# EAGLE schematic encore Main Board (EAGLE 9.6.2)
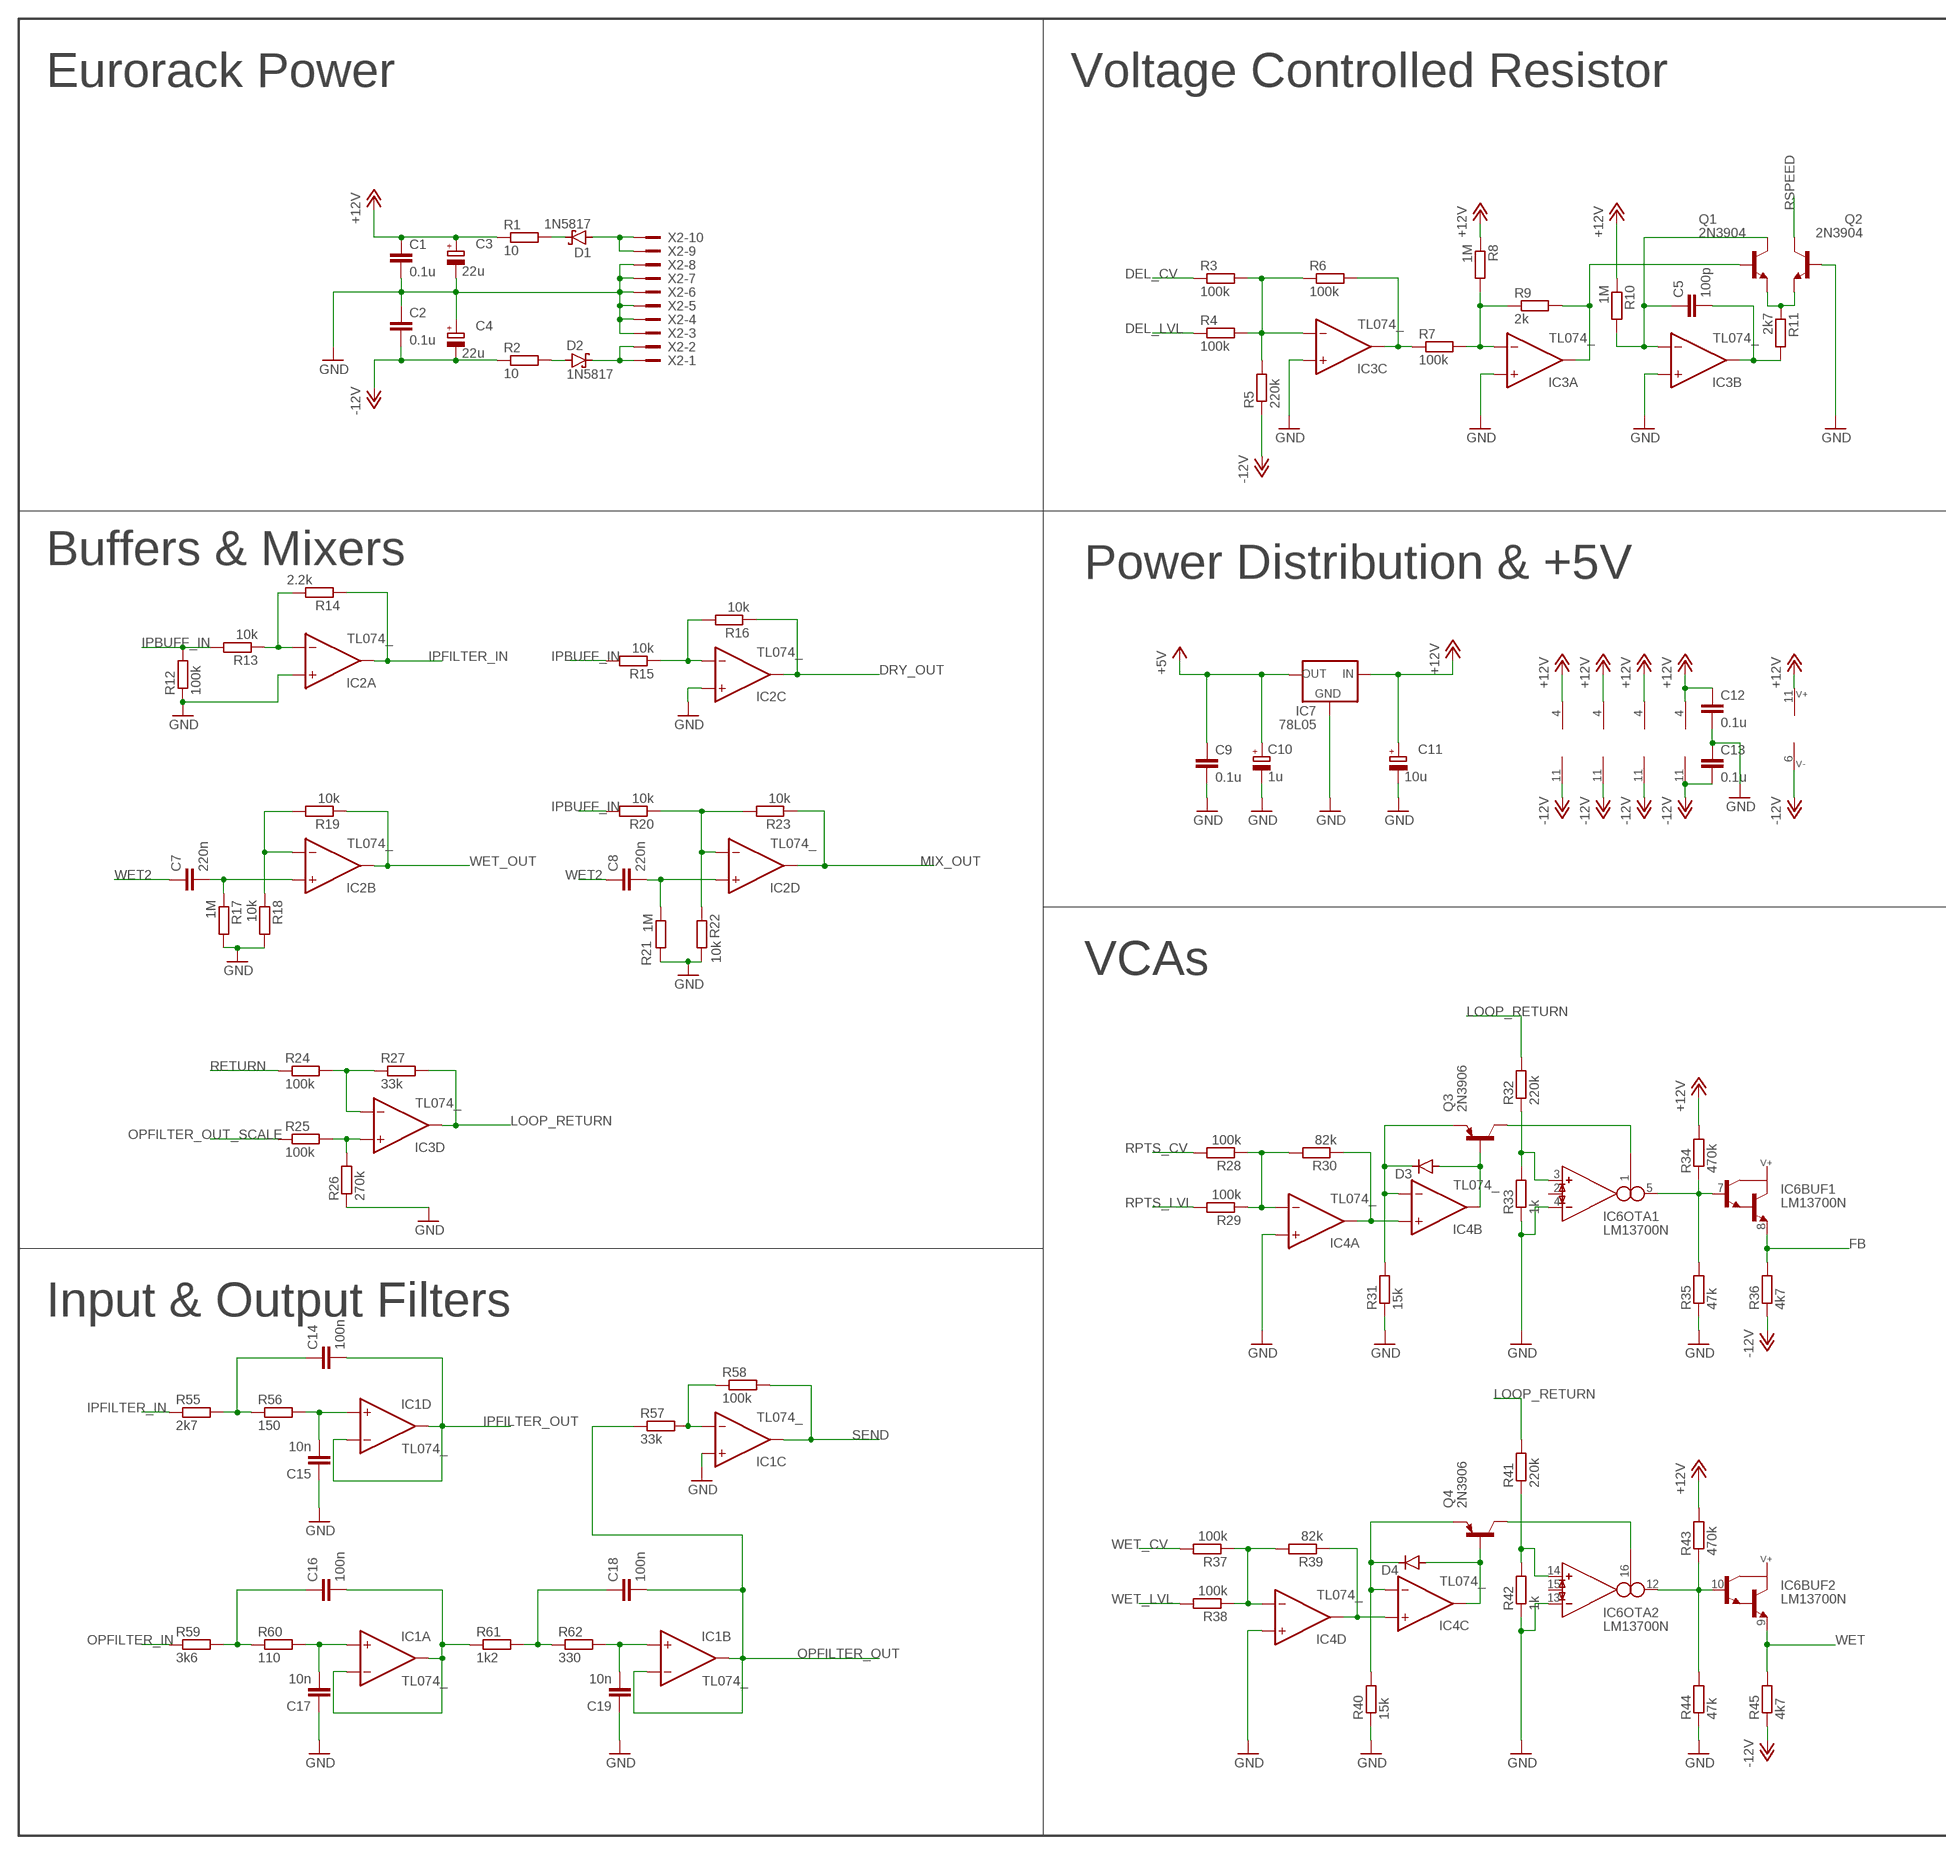
[diagram p0: schematic, sheet 1, part 1 of 2]
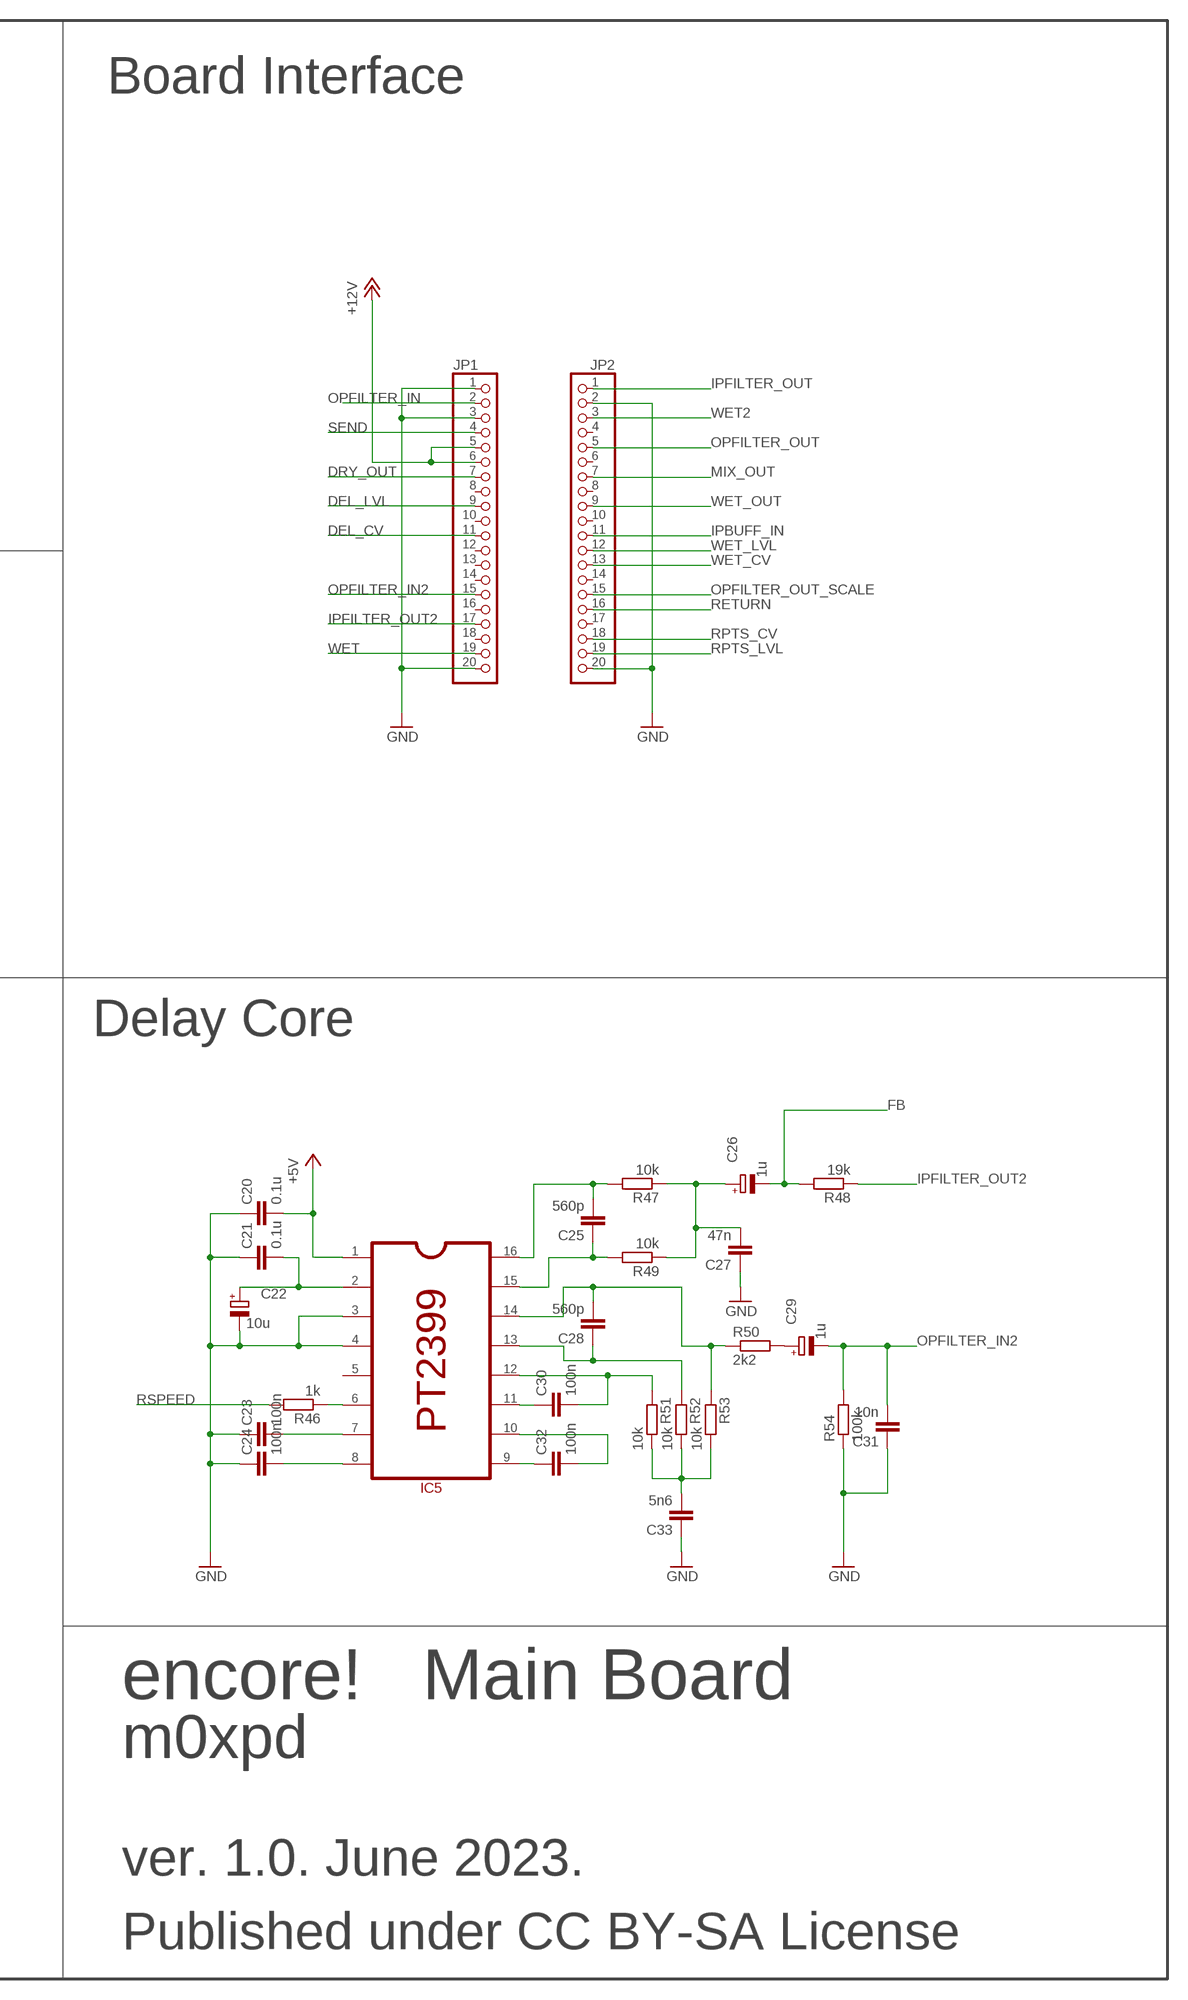
[diagram p1: schematic, sheet 1, part 2 of 2]

## Parts
C1  0.1u  C-EU050-025X075  [C050-025X075]
C2  0.1u  C-EU050-025X075  [C050-025X075]
C3  22u  CPOL-EUE2.5-5  [E2,5-5]
C4  22u  CPOL-EUE2.5-5  [E2,5-5]
C5  100p  C-EU025-025X050  [C025-025X050]
C7  220n  C-EU050-024X044  [C050-024X044]
C8  220n  C-EU050-024X044  [C050-024X044]
C9  0.1u  C-EU050-025X075  [C050-025X075]
C10  1u  CPOL-EUE2.5-5  [E2,5-5]
C11  10u  CPOL-EUE2.5-5  [E2,5-5]
C12  0.1u  C-EU050-025X075  [C050-025X075]
C13  0.1u  C-EU050-025X075  [C050-025X075]
C14  100n  C-EU025-025X050  [C025-025X050]
C15  10n  C-EU025-025X050  [C025-025X050]
C16  100n  C-EU025-025X050  [C025-025X050]
C17  10n  C-EU025-025X050  [C025-025X050]
C18  100n  C-EU025-025X050  [C025-025X050]
C19  10n  C-EU025-025X050  [C025-025X050]
C20  0.1u  C-EU050-025X075  [C050-025X075]
C21  0.1u  C-EU050-025X075  [C050-025X075]
C22  10u  CPOL-EUE2.5-5  [E2,5-5]
C23  100n  C-EU050-025X075  [C050-025X075]
C24  100n  C-EU050-025X075  [C050-025X075]
C25  560p  C-EU025-025X050  [C025-025X050]
C26  1u  CPOL-EUE2.5-5  [E2,5-5]
C27  47n  C-EU050-025X075  [C050-025X075]
C28  560p  C-EU025-025X050  [C025-025X050]
C29  1u  CPOL-EUE2.5-5  [E2,5-5]
C30  100n  C-EU050-025X075  [C050-025X075]
C31  10n  C-EU025-025X050  [C025-025X050]
C32  100n  C-EU050-025X075  [C050-025X075]
C33  5n6  C-EU050-025X075  [C050-025X075]
D1  1N5817  SCHOTTKY-DIODEDO35-7  [DO35-7]
D2  1N5817  SCHOTTKY-DIODEDO35-7  [DO35-7]
D3  1N4148DO35-7  [DO35-7]
D4  1N4148DO35-7  [DO35-7]
IC1  TL074_  [DIL14]
IC2  TL074_  [DIL14]
IC3  TL074_  [DIL14]
IC4  TL074_  [DIL14]
IC5  PT2399  [DIP-16]
IC6  LM13700N  [DIL16]
IC7  78L05  78LXX  [78LXX]
JP1  PINHD-1X20  [1X20]
JP2  PINHD-1X20  [1X20]
Q1  2N3904  [TO92]
Q2  2N3904  [TO92]
Q3  2N3906  [TO92]
Q4  2N3906  [TO92]
R1  10  R-EU_0204/7  [0204/7]
R2  10  R-EU_0204/7  [0204/7]
R3  100k  R-EU_0204/7  [0204/7]
R4  100k  R-EU_0204/7  [0204/7]
R5  220k  R-EU_0204/7  [0204/7]
R6  100k  R-EU_0204/7  [0204/7]
R7  100k  R-EU_0204/7  [0204/7]
R8  1M  R-EU_0204/7  [0204/7]
R9  2k  R-EU_0204/7  [0204/7]
R10  1M  R-EU_0204/7  [0204/7]
R11  2k7  R-EU_0204/7  [0204/7]
R12  100k  R-EU_0204/7  [0204/7]
R13  10k  R-EU_0204/7  [0204/7]
R14  2.2k  R-EU_0204/7  [0204/7]
R15  10k  R-EU_0204/7  [0204/7]
R16  10k  R-EU_0204/7  [0204/7]
R17  1M  R-EU_0204/7  [0204/7]
R18  10k  R-EU_0204/7  [0204/7]
R19  10k  R-EU_0204/7  [0204/7]
R20  10k  R-EU_0204/7  [0204/7]
R21  1M  R-EU_0204/7  [0204/7]
R22  10k  R-EU_0204/7  [0204/7]
R23  10k  R-EU_0204/7  [0204/7]
R24  100k  R-EU_0204/7  [0204/7]
R25  100k  R-EU_0204/7  [0204/7]
R26  270k  R-EU_0204/7  [0204/7]
R27  33k  R-EU_0204/7  [0204/7]
R28  100k  R-EU_0204/7  [0204/7]
R29  100k  R-EU_0204/7  [0204/7]
R30  82k  R-EU_0204/7  [0204/7]
R31  15k  R-EU_0204/7  [0204/7]
R32  220k  R-EU_0204/7  [0204/7]
R33  1k  R-EU_0204/7  [0204/7]
R34  470k  R-EU_0204/7  [0204/7]
R35  47k  R-EU_0204/7  [0204/7]
R36  4k7  R-EU_0204/7  [0204/7]
R37  100k  R-EU_0204/7  [0204/7]
R38  100k  R-EU_0204/7  [0204/7]
R39  82k  R-EU_0204/7  [0204/7]
R40  15k  R-EU_0204/7  [0204/7]
R41  220k  R-EU_0204/7  [0204/7]
R42  1k  R-EU_0204/7  [0204/7]
R43  470k  R-EU_0204/7  [0204/7]
R44  47k  R-EU_0204/7  [0204/7]
R45  4k7  R-EU_0204/7  [0204/7]
R46  1k  R-EU_0204/7  [0204/7]
R47  10k  R-EU_0204/7  [0204/7]
R48  19k  R-EU_0204/7  [0204/7]
R49  10k  R-EU_0204/7  [0204/7]
R50  2k2  R-EU_0204/7  [0204/7]
R51  10k  R-EU_0204/7  [0204/7]
R52  10k  R-EU_0204/7  [0204/7]
R53  10k  R-EU_0204/7  [0204/7]
R54  100k  R-EU_0204/7  [0204/7]
R55  2k7  R-EU_0204/7  [0204/7]
R56  150  R-EU_0204/7  [0204/7]
R57  33k  R-EU_0204/7  [0204/7]
R58  100k  R-EU_0204/7  [0204/7]
R59  3k6  R-EU_0204/7  [0204/7]
R60  110  R-EU_0204/7  [0204/7]
R61  1k2  R-EU_0204/7  [0204/7]
R62  330  R-EU_0204/7  [0204/7]
X2  2510-  [PAK100/2500-10]

## Nets
+5V: C9.1 C10.+ C20.2 IC5.1 IC7.OUT
+12V: C1.1 C3.+ C11.+ C12.1 IC1.4(P:V+) IC2.4(P:V+) IC3.4(P:V+) IC4.4(P:V+) IC6.11(SUPPLY:V+) IC7.IN JP1.5 JP1.6 R1.1 R8.1 R10.1 R34.2 R43.2
-12V: C2.2 C4.- C13.2 IC1.11(P:V-) IC2.11(P:V-) IC3.11(P:V-) IC4.11(P:V-) IC6.6(SUPPLY:V-) R2.1 R5.1 R36.1 R45.1
DEL_CV: JP1.11 R3.1
DEL_LVL: JP1.9 R4.1
DRY_OUT: IC2.8(C:OUT) JP1.7 R16.1
FB: C26.- IC6.8(BUF1:E) R36.2 R48.2
GND: C1.2 C2.1 C3.- C4.+ C9.2 C10.- C11.- C12.2 C13.1 C15.1 C17.1 C19.1 C20.1 C21.1 C22.- C23.1 C24.1 C27.1 C31.1 C33.1 IC1.10(C:+IN) IC2.3(A:+IN) IC2.10(C:+IN) IC3.3(A:+IN) IC3.5(B:+IN) IC3.10(C:+IN) IC4.3(A:+IN) IC4.12(D:+IN) IC5.3 IC5.4 IC6.4(OTA1:IN_N) IC6.13(OTA2:IN_N) IC7.GND JP1.1 JP1.3 JP1.20 JP2.2 JP2.20 Q2.2(B) R12.1 R17.2 R18.2 R21.2 R22.2 R26.1 R31.1 R33.1 R35.1 R40.1 R42.1 R44.1 R54.1 X2.3 X2.4 X2.5 X2.6 X2.7 X2.8
IPBUFF_IN: JP2.11 R12.2 R13.2 R15.2 R20.2
IPFILTER_IN: IC2.1(A:OUT) R14.1 R55.1
IPFILTER_OUT: C14.2 IC1.13(D:-IN) IC1.14(D:OUT) JP2.1
IPFILTER_OUT2: JP1.17 R48.1
LOOP_RETURN: IC3.14(D:OUT) R27.2 R32.2 R41.2
MIX_OUT: IC2.14(D:OUT) JP2.7 R23.1
N$1: IC3.1(A:OUT) Q1.2(B) R9.2
N$2: C15.2 IC1.12(D:+IN) R56.2
N$3: C5.1 IC3.6(B:-IN) Q1.1(C) R10.2
N$4: C14.1 R55.2 R56.1
N$5: C16.2 IC1.1(A:OUT) IC1.2(A:-IN) R61.1
N$6: C16.1 R59.2 R60.1
N$7: C17.2 IC1.3(A:+IN) R60.2
N$8: C5.2 IC3.7(B:OUT) R11.2
N$9: Q1.3(E) Q2.3(E) R11.1
N$10: C18.1 R61.2 R62.1
N$11: C19.2 IC1.5(B:+IN) R62.2
N$12: IC2.2(A:-IN) R13.1 R14.2
N$13: D1.A X2.9 X2.10
N$14: D1.C R1.2
N$17: IC2.6(B:-IN) R18.1 R19.2
N$18: C21.2 C22.+ IC5.2
N$19: IC1.9(C:-IN) R57.2 R58.1
N$20: IC6.5(OTA1:OUT) IC6.7(BUF1:B) R34.1 R35.2
N$21: C7.2 IC2.5(B:+IN) R17.1
N$22: IC3.12(D:+IN) R25.2 R26.2
N$23: C32.2 IC5.10
N$24: IC6.3(OTA1:IN_P) R32.1 R33.2
N$25: D3.A IC4.7(B:OUT) Q3.2(B)
N$26: D3.C IC4.6(B:-IN) Q3.3(E) R31.2
N$27: D2.A R2.2
N$28: D2.C X2.1 X2.2
N$29: IC6.1(OTA1:I_BIAS) Q3.1(C)
N$30: IC4.1(A:OUT) IC4.5(B:+IN) R30.1
N$31: IC5.6 R46.1
N$33: IC4.2(A:-IN) R28.1 R29.1 R30.2
N$35: IC4.10(C:+IN) IC4.14(D:OUT) R39.1
N$36: IC6.10(BUF2:B) IC6.12(OTA2:OUT) R43.1 R44.2
N$38: IC6.16(OTA2:I_BIAS) Q4.1(C)
N$39: IC6.14(OTA2:IN_P) R41.1 R42.2
N$40: D4.C IC4.9(C:-IN) Q4.3(E) R40.2
N$41: D4.A IC4.8(C:OUT) Q4.2(B)
N$42: IC3.2(A:-IN) R7.2 R8.2 R9.1
N$43: IC4.13(D:-IN) R37.1 R38.1 R39.2
N$46: IC3.8(C:OUT) R6.2 R7.1
N$47: C23.2 IC5.7
N$48: IC3.9(C:-IN) R3.2 R4.2 R5.2 R6.1
N$49: C24.2 IC5.8
N$50: C25.2 IC5.16 R47.2
N$52: C25.1 IC5.15 R49.2
N$53: C26.+ C27.2 R47.1 R49.1
N$54: C32.1 IC5.9
N$55: C28.2 IC5.14 R50.1 R53.1
N$56: C28.1 IC5.13 R52.1
N$57: C30.1 IC5.11
N$58: C30.2 IC5.12 R51.1
N$59: C33.2 R51.2 R52.2 R53.2
N$60: C29.+ R50.2
N$61: C8.2 IC2.12(D:+IN) R21.1
N$62: IC2.13(D:-IN) R20.1 R22.1 R23.2
N$65: IC3.13(D:-IN) R24.2 R27.1
N$66: IC2.9(C:-IN) R15.1 R16.2
OPFILTER_IN: JP1.2 R59.1
OPFILTER_IN2: C29.- C31.2 JP1.15 R54.2
OPFILTER_OUT: C18.2 IC1.6(B:-IN) IC1.7(B:OUT) JP2.5 R57.1
OPFILTER_OUT_SCALE: JP2.15 R25.1
RETURN: JP2.16 R24.1
RPTS_CV: JP2.18 R28.2
RPTS_LVL: JP2.19 R29.2
RSPEED: Q2.1(C) R46.2
SEND: IC1.8(C:OUT) JP1.4 R58.2
WET: IC6.9(BUF2:E) JP1.19 R45.2
WET2: C7.1 C8.1 JP2.3
WET_CV: JP2.13 R37.2
WET_LVL: JP2.12 R38.2
WET_OUT: IC2.7(B:OUT) JP2.9 R19.1
Unconnected: IC5.5 IC6.2(OTA1:I_DIODE) IC6.15(OTA2:I_DIODE) JP1.8 JP1.10 JP1.12 JP1.13 JP1.14 JP1.16 JP1.18 JP2.4 JP2.6 JP2.8 JP2.10 JP2.14 JP2.17

## Notes on the sheet
- Eurorack Power | Voltage Controlled Resistor | Board Interface
- Buffers & Mixers | Power Distribution & +5V
- VCAs | Delay Core
- Input & Output Filters
- encore!   Main Board
- m0xpd
- ver. 1.0. June 2023.
- Published under CC BY-SA License

## Library data of the parts
C1 C2 C5 C7-C9 C12-C21 C23-C25 C27 C28 C30-C33 = rcl:C-EU: CAPACITOR, European symbol; SPICEPREFIX: C
C3 C4 C10 C11 C22 C26 C29 = rcl:CPOL-EU: POLARIZED CAPACITOR, European symbol; SPICEPREFIX: C
D1 D2 = diode:SCHOTTKY-DIODE: Schottky Diode
D3 D4 = diode:1N4148: DIODE high speed (Philips)
IC1-IC4 = MusicThingModular:TL074: Generic Quad Op Amp
IC5 = ic-princeton-technologies:PT2399
IC6 = ota:LM13700: Dual OTA with buffers
IC7 = v-reg:78LXX: VOLTAGE REGULATOR
JP1 JP2 = pinhead:PINHD-1X20: PIN HEADER
Q1 Q2 = transistor-npn:2N3904: NPN Transistor
Q3 Q4 = transistor-pnp:2N3906: PNP Transistor
R1-R62 = rcl:R-EU_: RESISTOR, European symbol; SPICEPREFIX: R
X2 = con-3m:2510-: 3M (TM) Pak 100 4-Wall Header Source: 3M; MF: 3M; MPN: 2510-6002UB; OC_FARNELL: 9838244; OC_NEWARK: 46F4725